# Altium schematic sheet Buck Converter.SchDoc
size B; Organization: Current Products Corporation; Address1: 1995 Hollywood Ave; Address2: Pensacola, FL 32505
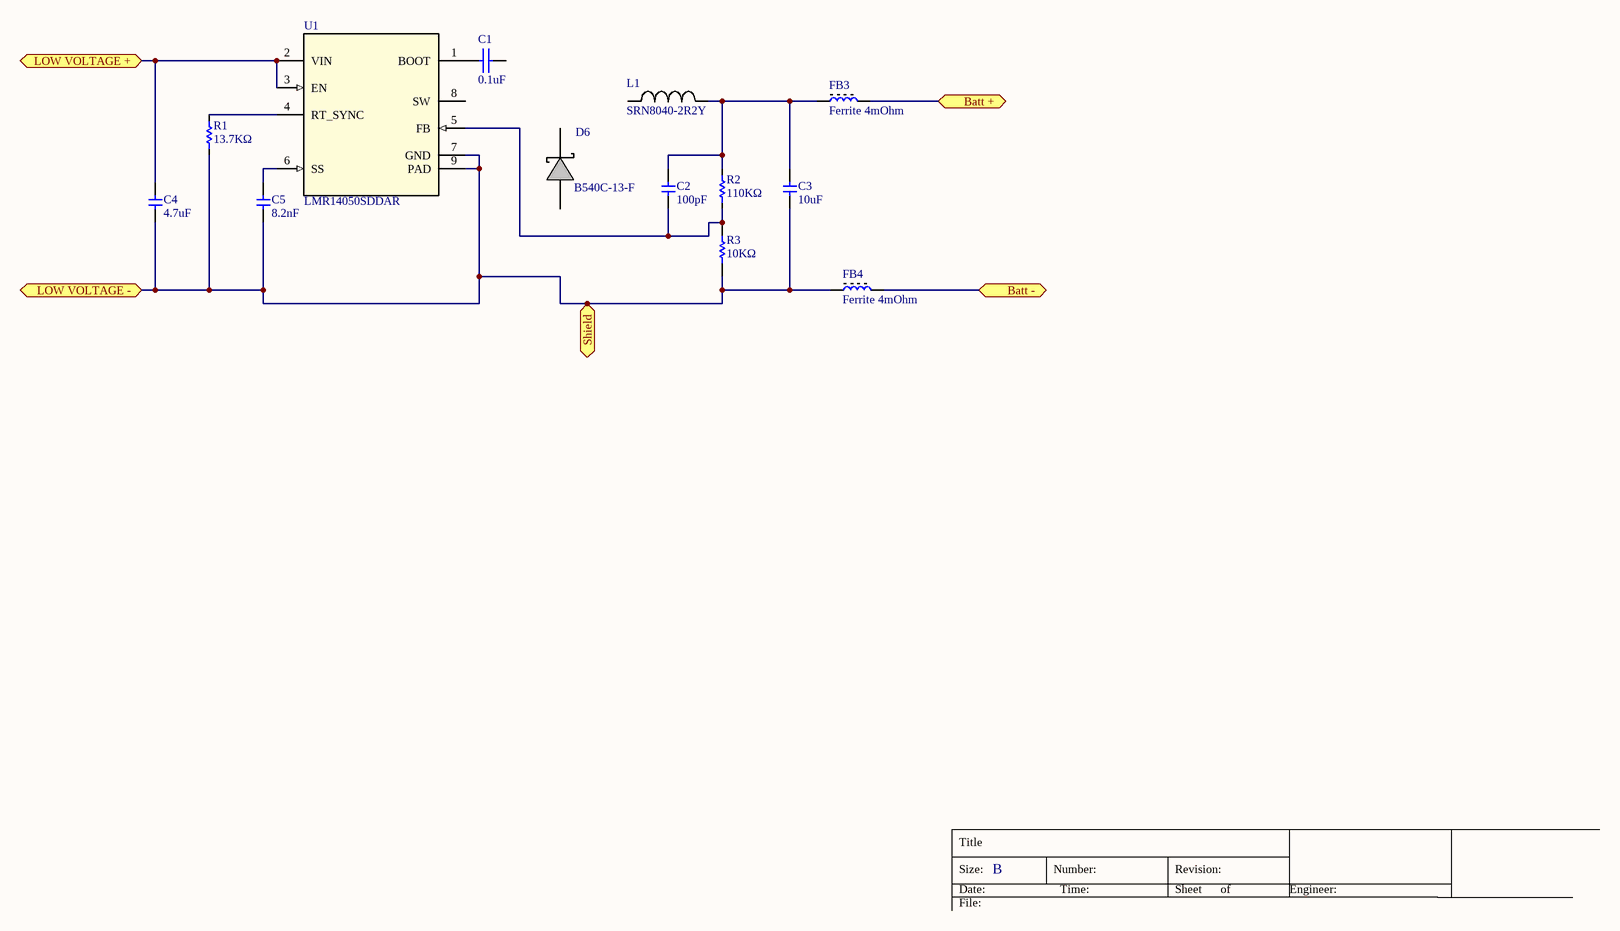
[diagram p0: Buck Converter.SchDoc]

## Parts
C1  0.1uF  [0603 Small]
C2  100pF  [0603 Capacitor]
C3  10uF  [0805 capacitor]
C4  4.7uF  [1206 - duplicate]
C5  8.2nF  [0402 Small]
D6  B540C-13-F  [SMC]
FB3  Ferrite 4mOhm  [0603 Inductor]
FB4  Ferrite 4mOhm  [0603 Inductor]
L1  SRN8040-2R2Y  [SRN8040 - Power Inductor]
R1  13.7KΩ  [0402 Small]
R2  110KΩ  [0603 Small]
R3  10KΩ  [0603 Small]
U1  LMR14050SDDAR  [SO8 - GROUND PAD]

## Ports
Batt +, Batt -, LOW VOLTAGE +, LOW VOLTAGE -, Shield

## Nets
Batt +: FB3.2 ; port Batt +
Batt -: FB4.2 ; port Batt -
LOW VOLTAGE +: C4.1 U1.2(VIN) U1.3(EN) ; port LOW VOLTAGE +
LOW VOLTAGE -: C3.2 C4.2 C5.2 FB4.1 R1.1 R3.1 U1.7(GND) U1.9(PAD) ; port LOW VOLTAGE -, port Shield
NetC1_1: C1.1 U1.1(BOOT)
NetC2_1: C2.1 C3.1 FB3.1 L1.2 R2.2
NetC2_2: C2.2 R2.1 R3.2 U1.5(FB)
NetC5_1: C5.1 U1.6(SS)
NetR1_2: R1.2 U1.4(RT_SYNC)

Not connected (* = marked no-connect by the designer): C1 2; D6 1(K) 2(A); L1 1; U1 8(SW)

## Notes on the sheet
- Title
- Size:
- Date:
- B
- Number:
- Time:
- Revision:
- Sheet
- of
- Engineer:
- File:

## Library data of the parts
C1 = CAP: CAP CER 0.1UF 50V 10% X7R 0603; Manufacturer: Murata Electronics; Manufacturer#: GRM188R71H104KA93J; Cost: 0.022
C2 = Cap: 100pF ±10% 16V Ceramic Capacitor X7R 0201 (0603 Metric); Manufacturer: Murata Electronics North America; Manufacturer#: GRM033R71C101KA01D; Cost: .00332
C3 = Cap: 10µF ±10% 16V Ceramic Capacitor X5R 0805 (2012 Metric); Manufacturer: Murata Electronics North America; Manufacturer#: GRM21BR61C106KE15L; Cost: .03964
C4 = Cap: 4.7µF ±10% 50V Ceramic Capacitor X7R 1206 (3216 Metric); Manufacturer: Taiyo Yuden; Manufacturer#: UMK316AB7475KL-T; Cost: .05832
C5 = Cap: 8200pF ±10% 16V Ceramic Capacitor X7R 0402 (1005 Metric); Manufacturer: Murata Electronics North America; Manufacturer#: GRM155R71C822KA01D; Cost: .00863
D6 = B540C-13-F: DIODE SCHOTTKY 40V 5A SMC; Manufacturer: Diodes Incorporated; Vendor: Diodes Inc.; Type: DEV; Datasheet_URL: http://www.diodes.com/datasheets/ds13012.pdf; Manufacturer_Part_Number: B540C-13-F; Manufacturer_Name: Diodes Inc.; RefDes: RefDes; Value: Value; Manufacturer#: B540C-13-F; Cost: .21187
FB3 FB4 = Ferrite Bead: Manufacturer: Murata Electronics North America; Manufacturer#: BLM18SN220TN1D; Cost: 0.04125
L1 = SRN8040-2R2Y: 2.2µH Shielded Wirewound Inductor 6.3A 13 mOhm Max Nonstandard; Vendor: Bourns; Type: DEV; Datasheet_URL: http://www.bourns.com/data/global/pdfs/SRN8040.pdf; Manufacturer#: SRN8040-2R2Y; Manufacturer: Bourns; RefDes: RefDes; Value: Value; Cost: .30106
R1 = Resistor: 13.7k Ohm ±1% 0.063W, 1/16W Chip Resistor 0402 (1005 Metric) Automotive AEC-Q200 Thick Film; Manufacturer: Vishay Dale; Manufacturer#: CRCW040213K7FKED; Cost: .00641
R2 = Resistor: 110k Ohm ±1% 0.1W, 1/10W Chip Resistor 0603 (1608 Metric) Moisture Resistant Thick Film; Manufacturer: Yageo; Manufacturer#: RC0603FR-07110KL; Cost: .00223
R3 = Res1: Thick Film Resistors - SMD 0603 10Kohms 1% Tol; Manufacturer: Panasonic; Manufacturer#: ERJ-3EKF1002V; Cost: 0.002
U1 = LMR14050SDDAR: Buck Switching Regulator IC Positive Adjustable 0.8V 1 Output 5A 8-PowerSOIC (0.154", 3.90mm Width); Manufacturer: Texas Instruments; PIN_COUNT: 9; Application_BuildNumber: *; PartNumber: LMR14050SDDAR; PackageReference: DDA0008E; MountType: SMT; CompType: IC; RoHS: Y; RefDes: RefDes; Type: DEV; Value: Value; Manufacturer_Part_Number: LMR14050SDDAR; Manufacturer_Name: Texas Instruments; Alternate_PartNumber: LMR14050SDDA; Manufacturer#: LMR14050SDDA; Cost: 2.9484